# Altium schematic sheet Safety Loop.SchDoc
size A4; SheetNumber: 4; SheetTotal: 11
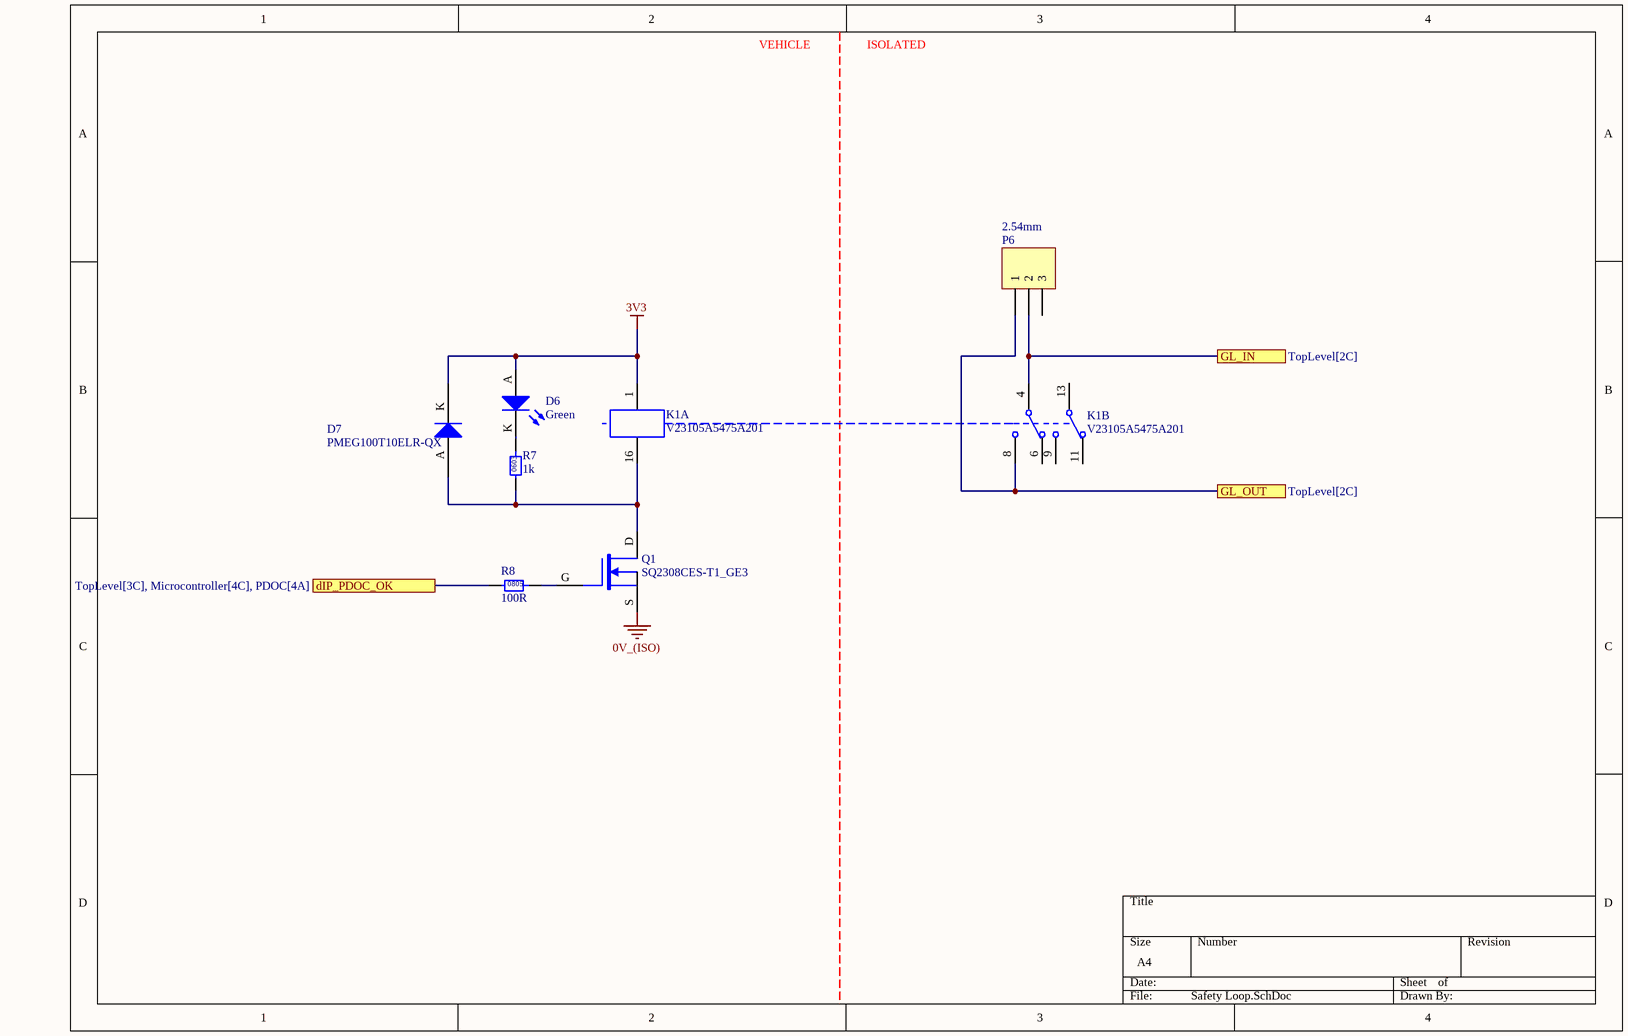
[diagram p0: Safety Loop.SchDoc]

## Parts
D6  Green  [0805 LED]
D7  PMEG100T10ELR-QX  [SODFL350X110-2N]
K1  V23105A5475A201  [TI 2-DIL]  (parts A,B of 2)
P6  2.54mm  [TH 2.54mm Header 1x3]
Q1  SQ2308CES-T1_GE3  [VSHY SOT-23-3]
R7  1k  [0603]
R8  100R  [0805]

## Ports
dIP_PDOC_OK (see TopLevel[3C], Microcontroller[4C], PDOC[4A]), GL_IN (see TopLevel[2C]), GL_OUT (see TopLevel[2C])

## Nets
0V_(ISO): Q1.S
3V3: D6.A D7.K K1.1
dIP_PDOC_OK: R8.1 ; port dIP_PDOC_OK
GL_IN: K1.4 P6.2 ; port GL_IN
GL_OUT: K1.8 P6.1 ; port GL_OUT
NetD6_K: D6.K R7.2
NetD7_A: D7.A K1.16 Q1.D R7.1
NetQ1_G: Q1.G R8.2

Not connected (* = marked no-connect by the designer): K1 6 9 11 13; P6 3

## Notes on the sheet
- VEHICLE
- ISOLATED
- (in symbol RC0603FR-071KL) 0603
- (in symbol RC0805FR07100RL) 0805

## Library data of the parts
D6 = SML-210FTT86: Green LED Indication - Discrete 1.75V 0805 (2012 Metric); Manufacturer: ROHM Semiconductor; Part Number: SML-210FTT86; Colour: Green; Digikey Part Number: 511-1285-1-ND
D7 = CMP-004-00005-4: Diode 100 V 1A Surface Mount SOD-123W
K1 = CMP-036-000001-1: 5V DPDT Relay 3A 220VDC; Part Number: V23105A5475A201
P6 = TH 2.54mm Header 1x3: Positions: 3; Angle: 0; Flange: No; Contact: NA; Part Number: TH 2.54mm Header 1x3; Pitch: 2.54mm; Row Spacing: 2.54mm
Q1 = SQ2308CES-T1_GE3: MOSFET N-CH 60V 2.3A SOT23; Manufacturer: Vishay Siliconix; Type: N-channel; Rated Power: 2W; Published: 24-Mar-1999; LatestRevisionDate: 29-May-2009; LatestRevisionNote: IPC-7351 Footprint Added.; PackageVersion: Sep-2000; PackageReference: SOT-343; Publisher: Altium Limited; PackageDescription: 4-Pin SOT-343 Package 1.3 mm Pitch, 2.1 mm Lead Span; Part Number: SQ2308CES-T1_GE3; Digikey Part Number: SQ2308CES-T1_GE3CT-ND
R7 = RC0603FR-071KL: Manufacturer: YAGEO; Tolerance: 0.01; Rated Power: 0.1W; Part Number: RC0603FR-071KL; Value: 1k; Digikey Part Number: 311-1.00KHRCT-ND; Material: FR-07
R8 = RC0805FR07100RL: Manufacturer: YAGEO; Tolerance: 0.01; Rated Power: 0.125W; Part Number: RC0805FR07100RL; Value: 100R; Material: FR-07; Digikey Part Number: 311-100CRCT-ND